# EAGLE design 620_pico (EAGLE 9.6.2)
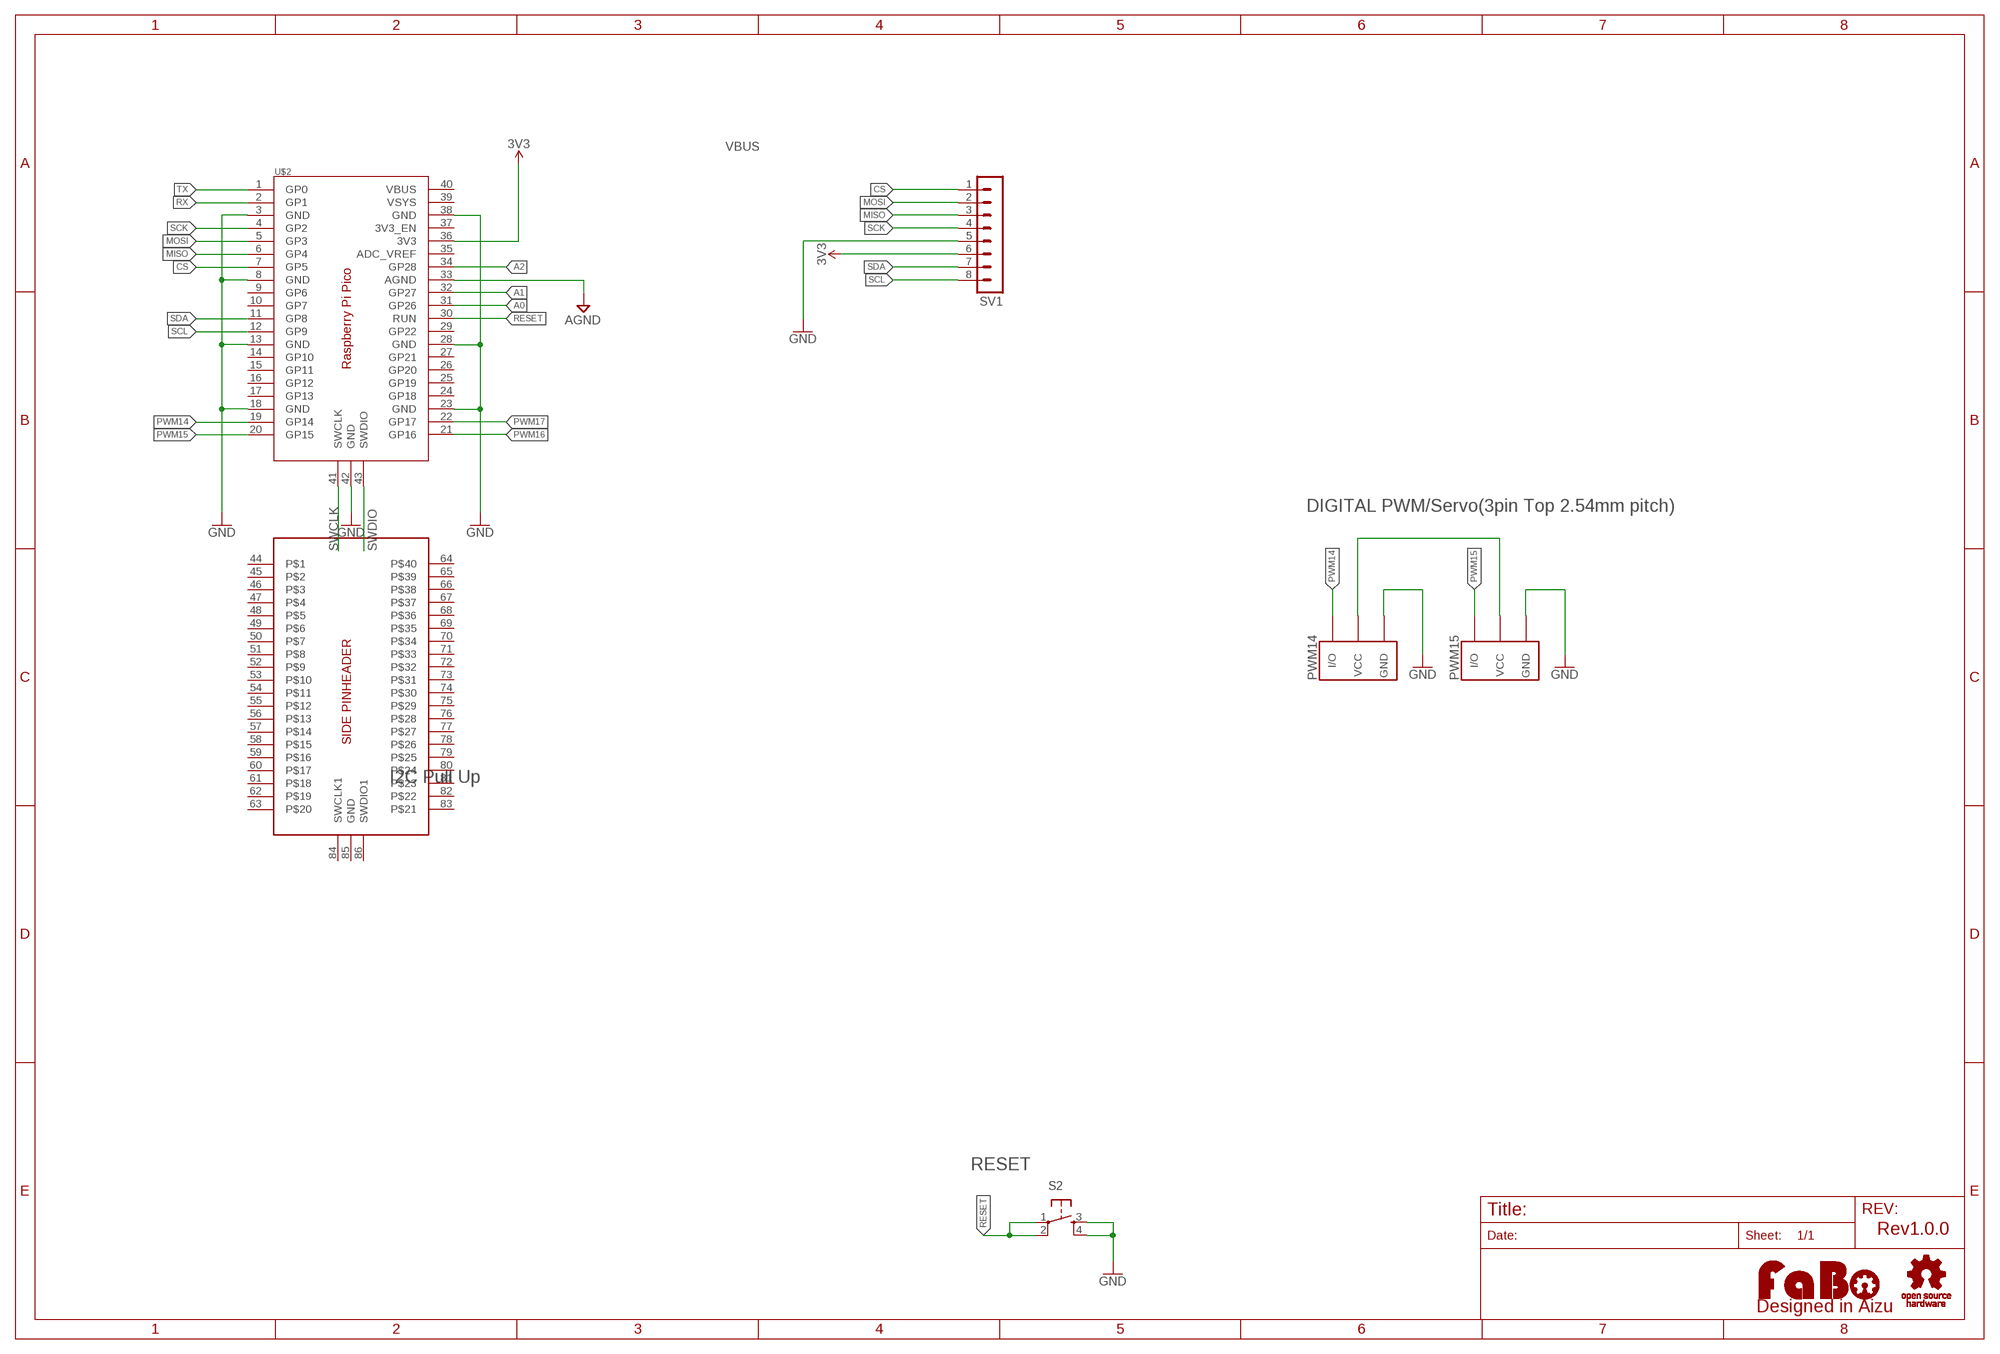
[diagram p0: schematic, sheet 1]

## Parts
LOGO1  LOGO_OSHW-M_BOTTOM  [LOGO_OSHW_M_BOTTOM]
LOGO2  LOGO_FABO-M  [LOGO_FABO_M]
PWM14  FABO_BRICK_3PIN-HEADER  [FABO_BRICK_3PIN_HEADER]
PWM15  FABO_BRICK_3PIN-HEADER  [FABO_BRICK_3PIN_HEADER]
S2  TACT-SWITCH-SMD_KMR2  [KMR2]
SV1  MA08-1  [MA08-1]
U$2  RASPBERRY_PI_PICO_BOTH_TH_PINHEADER  [RASPBERRY_PI_PICO_HEADER_BOTH]

## Nets
3V3: SV1.6 U$2.36(3V3)
A0: U$2.31(GP26)
A1: U$2.32(GP27)
A2: U$2.34(GP28)
AGND: U$2.33(AGND)
CS: SV1.1 U$2.7(GP5)
GND: PWM14.GND PWM15.GND S2.3 S2.4 SV1.5 U$2.3(GND) U$2.8(GND) U$2.13(GND) U$2.18(GND) U$2.23(GND) U$2.28(GND) U$2.38(GND) U$2.42(GND)
MISO: SV1.3 U$2.6(GP4)
MOSI: SV1.2 U$2.5(GP3)
PWM14: PWM14.I/O U$2.19(GP14)
PWM15: PWM15.I/O U$2.20(GP15)
PWM16: U$2.21(GP16)
PWM17: U$2.22(GP17)
RESET: S2.1 S2.2 U$2.30(RUN)
RX: U$2.2(GP1)
SCK: SV1.4 U$2.4(GP2)
SCL: SV1.8 U$2.12(GP9)
SDA: SV1.7 U$2.11(GP8)
SWCLK: U$2.41(SWCLK)
SWDIO: U$2.43(SWDIO)
TX: U$2.1(GP0)
VBUS: PWM14.VCC PWM15.VCC
Unconnected: U$2.9(GP6) U$2.10(GP7) U$2.14(GP10) U$2.15(GP11) U$2.16(GP12) U$2.17(GP13) U$2.24(GP18) U$2.25(GP19) U$2.26(GP20) U$2.27(GP21) U$2.29(GP22) U$2.35(ADC_VREF) U$2.37(3V3_EN) U$2.39(VSYS) U$2.40(VBUS) U$2.44 U$2.45 U$2.46 U$2.47 U$2.48 U$2.49 U$2.50 U$2.51 U$2.52 U$2.53 U$2.54 U$2.55 U$2.56 U$2.57 U$2.58 U$2.59 U$2.60 U$2.61 U$2.62 U$2.63 U$2.64 U$2.65 U$2.66 U$2.67 U$2.68 U$2.69 U$2.70 U$2.71 U$2.72 U$2.73 U$2.74 U$2.75 U$2.76 U$2.77 U$2.78 U$2.79 U$2.80 U$2.81 U$2.82 U$2.83 U$2.84(SWCLK1) U$2.85(GND) U$2.86(SWDIO1)

## Notes on the sheet
- DIGITAL PWM/Servo(3pin Top 2.54mm pitch)
- I2C Pull Up
- RESET
- Rev1.0.0

## Library data of the parts
LOGO1 = FaBo-Logo:LOGO_OSHW
LOGO2 = FaBo-Logo:LOGO_FABO
PWM14 PWM15 = FaBo-Template:FABO_BRICK_3PIN: FaBo Brick 3pin
S2 = FaBo-Switch:TACT-SWITCH: Part No Maker Datasheet Distributor 1273HA-160G-G SWITRONIC Catalog <http://www.switronic.com/uploads/images/A10.gif> Akizuki <http://akizukidenshi.com/catalog/g/gP-02561/> DTS-6-V Cosland DTS 6 Series <http://www.cosland.com/newproduct/DTS%20SERIES.pdf> Akizuki <http://akizukidenshi.com/catalog/g/gP-03647/> KMR2 C&K KMR2 SERIES <https://www.ckswitches.com/products/switches/product-details/Tactile/KMR2/> Octoparts Result <https://octopart.com/search?q=KMR2&start=0> TSHA-T-XB2-19E TOP UP INDUSTORY TSHA-T <http://www.top-up.com.tw/front/bin/ptdetail.phtml?Part=TSHA-T> Akizuki <http://akizukidenshi.com/catalog/g/gP-09361/>
SV1 = con-lstb:MA08-1: PIN HEADER; OC_FARNELL: unknown; OC_NEWARK: unknown
U$2 = FaBo-Boards:RASPBERRY_PI_PICO_BOTH_TH_PINHEADER

## Board
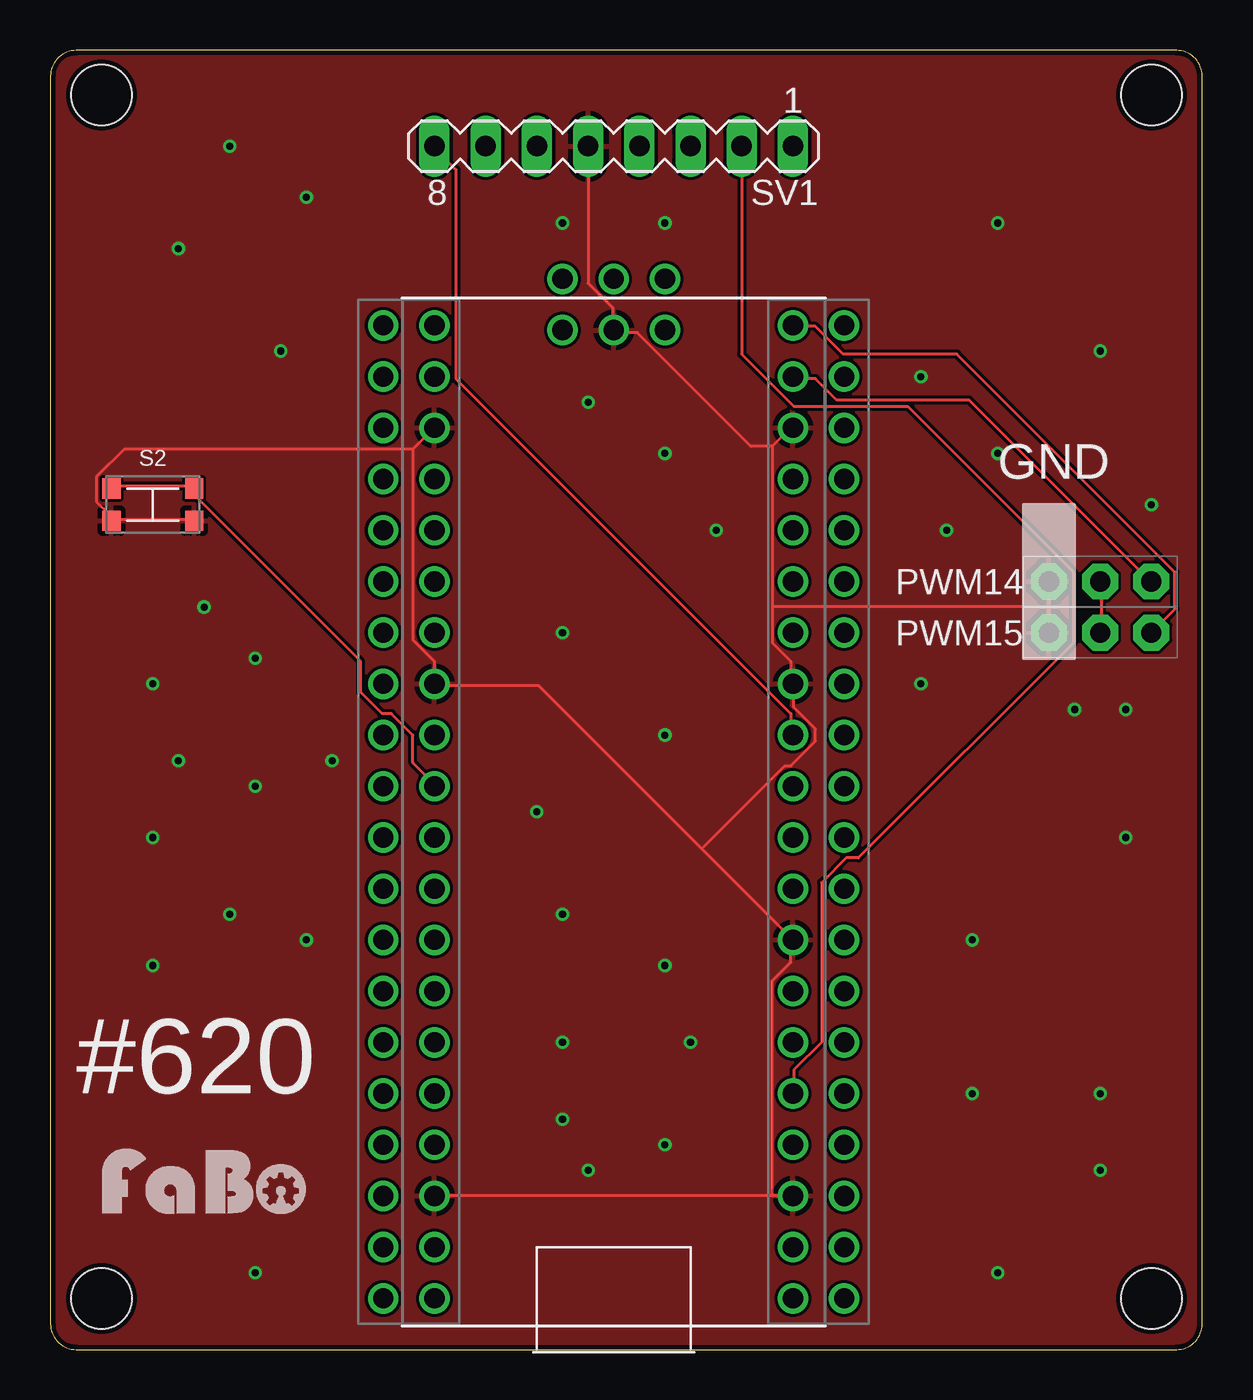
[diagram p1: board, top side]
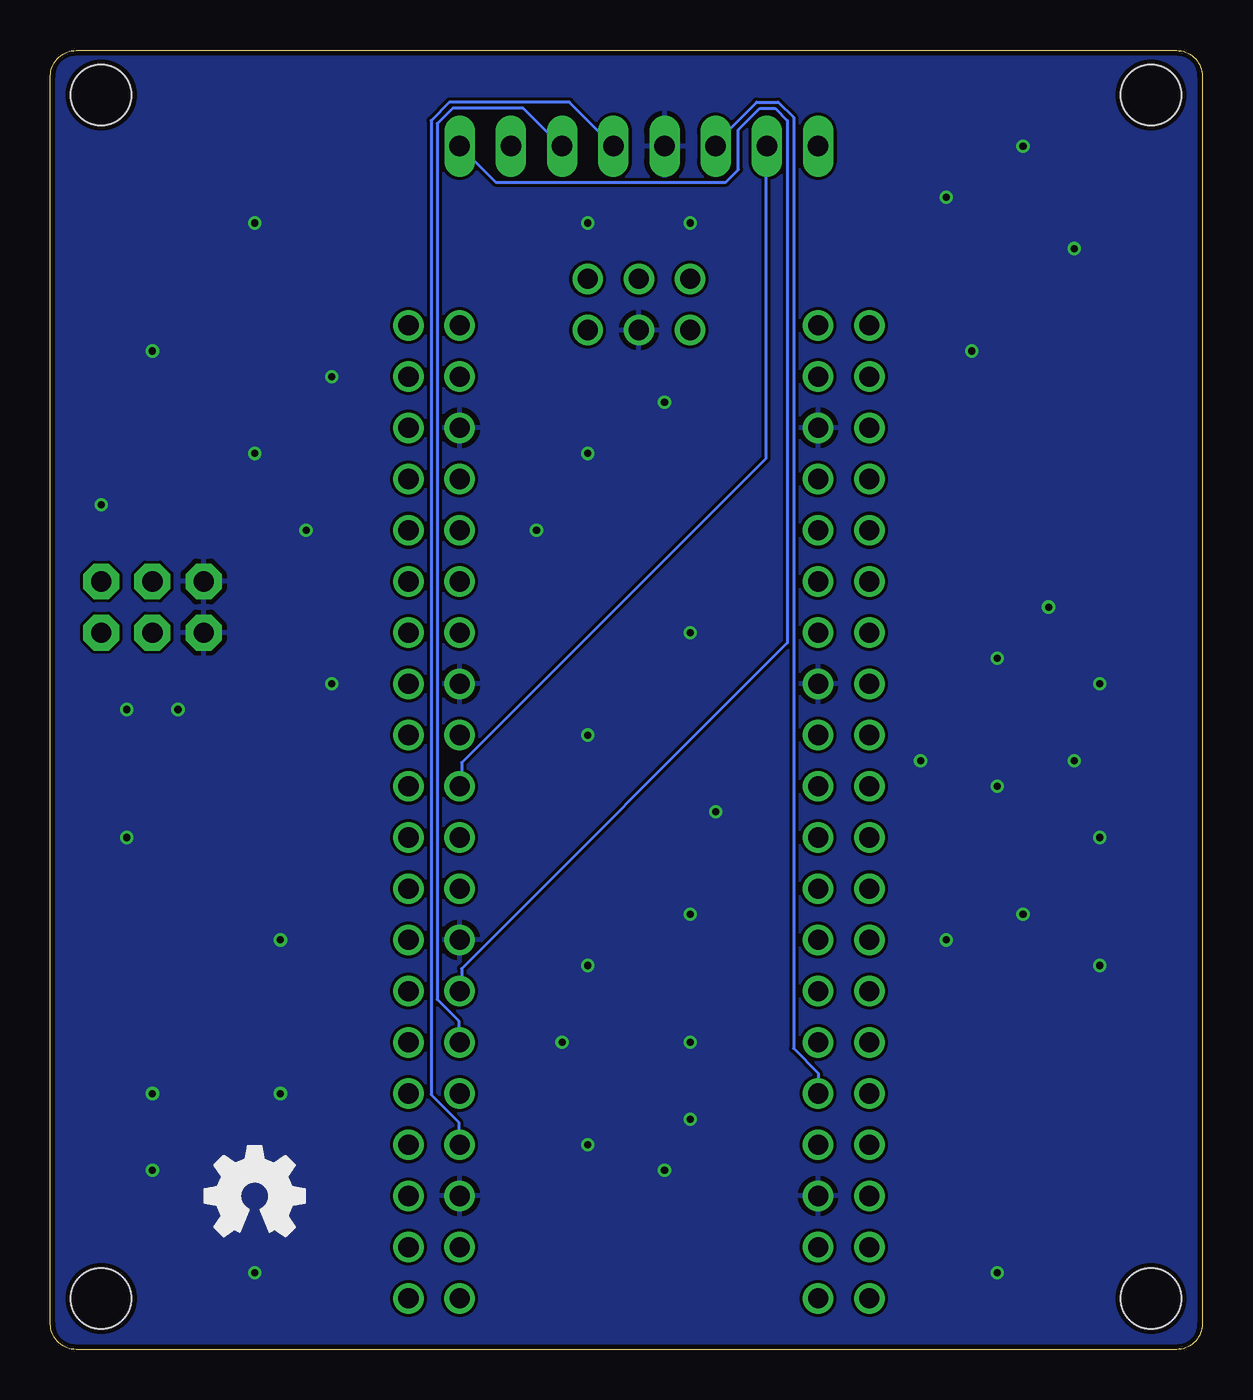
[diagram p2: board, bottom side, seen from below]

Size 57.13 x 64.44 mm. Coordinates in mm from the lower left corner, seen from the top.
Outline: 0,63.17 0,1.27 arc90 1.27,0 55.86,0 arc90 57.13,1.27 57.13,63.17 arc90 55.86,64.44 1.27,64.44 arc90 0,63.17
Copper layers (1*16): Top 0.035mm / dielectric 1.5mm / Bottom 0.035mm
Design rules "SeeedStudio_2layer_DRU_no_angle_20140221": minimum track width 6mil, minimum drill 12mil, track to track 6mil, track to pad 6mil, pad to pad 6mil, via to via 6mil, smd to smd 0mil, copper to edge 10mil, drill to drill 10mil, minimum pad ring 10mil, minimum via ring 6mil, stop-mask expansion 2mil, vias tented up to drill 100mil, thermal gap 10mil
Holes 3 mm at 2.54,62.23 54.61,62.23 54.61,2.54 2.54,2.54

### Footprints (pad centres in the part's own frame; a part is rotated, then mirrored left to right if it is on the bottom)
FABO_BRICK_3PIN_HEADER = drill 1 pad 1.778 octagon: GND -2.54,0; I/O 2.54,0; VCC 0,0
KMR2 = smd 0.9 x 1: 1 -2.05,0.8; 2 2.05,0.8; 3 2.05,-0.8; 4 -2.05,-0.8
MA08-1 = drill 1.016 long: 1 -8.89,0; 2 -6.35,0; 3 -3.81,0; 4 -1.27,0; 5 1.27,0; 6 3.81,0; 7 6.35,0; 8 8.89,0
RASPBERRY_PI_PICO_HEADER_BOTH = drill 1: 1 -8.89,24.13; 2 -8.89,21.59; 3 -8.89,19.05; 4 -8.89,16.51; 5 -8.89,13.97; 6 -8.89,11.43; 7 -8.89,8.89; 8 -8.89,6.35; 9 -8.89,3.81; 10 -8.89,1.27; 11 -8.89,-1.27; 12 -8.89,-3.81; 13 -8.89,-6.35; 14 -8.89,-8.89; 15 -8.89,-11.43; 16 -8.89,-13.97; 17 -8.89,-16.51; 18 -8.89,-19.05; 19 -8.89,-21.59; 20 -8.89,-24.13; 21 8.89,-24.13; 22 8.89,-21.59; 23 8.89,-19.05; 24 8.89,-16.51; 25 8.89,-13.97; 26 8.89,-11.43; 27 8.89,-8.89; 28 8.89,-6.35; 29 8.89,-3.81; 30 8.89,-1.27; 31 8.89,1.27; 32 8.89,3.81; 33 8.89,6.35; 34 8.89,8.89; 35 8.89,11.43; 36 8.89,13.97; 37 8.89,16.51; 38 8.89,19.05; 39 8.89,21.59; 40 8.89,24.13; 41 -2.54,-23.9; 42 0,-23.9; 43 2.54,-23.9; 44 -11.43,24.13; 45 -11.43,21.59; 46 -11.43,19.05; 47 -11.43,16.51; 48 -11.43,13.97; 49 -11.43,11.43; 50 -11.43,8.89; 51 -11.43,6.35; 52 -11.43,3.81; 53 -11.43,1.27; 54 -11.43,-1.27; 55 -11.43,-3.81; 56 -11.43,-6.35; 57 -11.43,-8.89; 58 -11.43,-11.43; 59 -11.43,-13.97; 60 -11.43,-16.51; 61 -11.43,-19.05; 62 -11.43,-21.59; 63 -11.43,-24.13; 64 11.43,24.13; 65 11.43,21.59; 66 11.43,19.05; 67 11.43,16.51; 68 11.43,13.97; 69 11.43,11.43; 70 11.43,8.89; 71 11.43,6.35; 72 11.43,3.81; 73 11.43,1.27; 74 11.43,-1.27; 75 11.43,-3.81; 76 11.43,-6.35; 77 11.43,-8.89; 78 11.43,-11.43; 79 11.43,-13.97; 80 11.43,-16.51; 81 11.43,-19.05; 82 11.43,-21.59; 83 11.43,-24.13; 84 -2.54,-26.44; 85 0,-26.44; 86 2.54,-26.44

### Placement (x,y rotation side)
LOGO1  46.99,7.62 0 top
LOGO2  7.62,6.35 0 top
PWM14  52.07,38.1 0 top
PWM15  52.07,35.56 0 top
S2  5.08,41.91 0 top
SV1  27.94,59.69 180 top
U$2  27.94,26.67 180 top

### Tracks (layer width: path | path; a pad name or v marks a point on that pad's centre or on a via)
3V3
  Bottom 0.152: U$2.36 19.05,13.72 20.27,14.94 20.27,61.11 21.03,61.87 22.1,61.87 24.23,59.74 SV1.6
CS
  Bottom 0.152: SV1.1 35.05,57.91 23.62,57.91 23.01,58.52 23.01,60.5 21.95,61.57 21.18,61.57 20.57,60.96 20.57,35.05 36.73,18.9 36.73,17.83 U$2.7
GND  (via drill 0.35)
  Top 0.152: SV1.5 26.67,52.88 27.89,51.66 27.89,50.6 U$2.42 28.04,50.44 29.11,50.44 34.75,44.81 35.81,44.81 | PWM14.GND 49.53,36.88 | 49.53,36.88 PWM15.GND | 35.81,44.81 35.81,36.88 | 35.81,36.88 35.81,35.05 36.73,34.14 36.73,33.07 U$2.13 36.88,32.92 36.88,31.85 37.95,30.79 37.95,30.18 36.73,28.96 36.42,28.96 32.31,24.84 | 35.81,44.81 36.73,45.72 U$2.18 | 35.81,36.88 49.53,36.88 | S2.3 7.01,41.15 3.05,41.15 S2.4 2.9,41.15 2.9,41.45 2.29,42.06 2.29,43.28 3.66,44.65 17.98,44.65 | U$2.23 17.98,44.65 | 17.98,44.65 17.98,35.2 19.05,34.14 U$2.28 19.05,32.92 24.23,32.92 32.31,24.84 | U$2.3 35.81,7.62 | 35.81,7.62 U$2.38 | 35.81,7.62 35.81,18.29 36.73,19.2 36.73,20.27 U$2.8 32.31,24.84
  other vias: 43.18,48.26 30.48,44.45 11.43,49.53 12.7,57.15 6.35,54.61 5.08,33.02 10.16,34.29 10.16,27.94 5.08,25.4 25.4,21.59 25.4,35.56 44.45,40.64 46.99,55.88 52.07,49.53 53.34,25.4 45.72,20.32 52.07,12.7 45.72,12.7 30.48,10.16 25.4,15.24 8.89,21.59 5.08,19.05 10.16,3.81 30.48,30.48 33.02,40.64 43.18,33.02 53.34,31.75 50.8,31.75 54.61,41.91 46.99,44.45 8.89,59.69 25.4,55.88 30.48,55.88 26.67,46.99 12.7,20.32 13.97,29.21 6.35,29.21 7.62,36.83 24.13,26.67 30.48,19.05 31.75,15.24 25.4,11.43 26.67,8.89 52.07,8.89 46.99,3.81
  pour Top: 0,0 57.15,0 57.15,64.77 0,64.77
  pour Bottom: 0,0 57.15,0 57.15,64.77 0,64.77
MISO
  Bottom 0.152: U$2.6 36.88,15.24 36.88,16.31 37.95,17.37 37.95,60.81 37.19,61.57 33.68,61.57 31.85,59.74 SV1.3
MOSI
  Top 0.152: SV1.2 34.29,49.38 36.88,46.79 42.52,46.79 50.75,38.56 50.75,35.05 40.08,24.38 39.47,24.38 38.25,23.16 38.25,15.24 36.88,13.87 36.88,12.8 U$2.5
PWM14
  Top 0.152: U$2.19 36.88,48.16 37.95,48.16 39.01,47.09 45.57,47.09 54.56,38.1 PWM14.I/O
PWM15
  Top 0.152: PWM15.I/O 55.78,36.73 55.78,38.56 44.96,49.38 39.32,49.38 37.95,50.75 36.88,50.75 U$2.20
RESET
  Top 0.152: S2.1 3.05,42.82 7.01,42.82 S2.2 7.16,42.67 7.16,42.37 15.39,34.14 15.39,32.61 16.46,31.55 16.92,31.55 17.98,30.48 17.98,29.11 19.05,28.04 U$2.30
SCK
  Bottom 0.152: SV1.4 31.39,61.87 37.34,61.87 38.25,60.96 38.25,12.65 36.88,11.28 36.88,10.21 U$2.4
SCL
  Top 0.152: U$2.12 36.73,30.48 36.73,31.55 20.12,48.16 20.12,58.52 19.05,59.59 SV1.8
SDA
  Bottom 0.152: U$2.11 36.73,28.04 36.73,29.11 21.64,44.2 21.64,59.59 SV1.7
VBUS
  Top 0.152: PWM15.VCC 52.12,35.66 52.12,38.1 PWM14.VCC

### Text on the board
tPlace: GND | #620